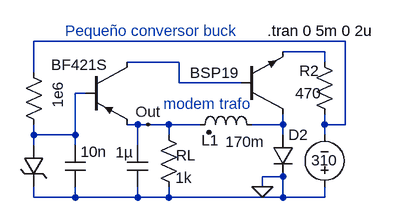
[diagram p0: schematic 2Q_Small_Buck_220_12_NpnOut.asc]
2Q_Small_Buck_220_12_NpnOut.asc, the LTspice schematic file:
Version 4
SHEET 1 1624 1340
WIRE -144 -80 -624 -80
WIRE -176 -64 -240 -64
WIRE -400 -48 -480 -48
WIRE -176 -48 -176 -64
WIRE -624 -32 -624 -80
WIRE -400 -16 -400 -48
WIRE -304 -16 -400 -16
WIRE -544 0 -560 0
WIRE -464 48 -480 48
WIRE -448 48 -464 48
WIRE -416 48 -448 48
WIRE -368 48 -416 48
WIRE -240 48 -240 32
WIRE -240 48 -288 48
WIRE -176 48 -176 32
WIRE -144 48 -144 -80
WIRE -144 48 -176 48
WIRE -624 64 -624 48
WIRE -560 64 -560 0
WIRE -560 64 -624 64
WIRE -416 64 -416 48
WIRE -240 64 -240 48
WIRE -176 64 -176 48
WIRE -624 80 -624 64
WIRE -560 80 -560 64
WIRE -464 80 -464 48
WIRE -240 128 -272 128
WIRE -272 144 -272 128
WIRE -624 160 -624 144
WIRE -560 160 -560 144
WIRE -560 160 -624 160
WIRE -464 160 -464 144
WIRE -464 160 -560 160
WIRE -416 160 -416 144
WIRE -416 160 -464 160
WIRE -240 160 -240 128
WIRE -240 160 -416 160
WIRE -176 160 -176 144
WIRE -176 160 -240 160
FLAG -272 144 0
FLAG -448 48 Out
SYMBOL voltage -176 160 R180
WINDOW 3 0 73 Bottom 0
WINDOW 123 -32 56 VBottom 0
WINDOW 0 -12 58 Invisible 0
SYMATTR Value 310
SYMATTR InstName V2
SYMATTR SpiceLine Rser=.01
SYMBOL ind2 -272 64 M270
WINDOW 0 -24 80 VTop 0
WINDOW 3 5 26 VBottom 0
SYMATTR InstName L1
SYMATTR Value 170m
SYMATTR SpiceLine Rser=140
SYMBOL npn2 -304 32 M180
WINDOW 0 56 32 Invisible 0
WINDOW 3 -79 64 Left 0
SYMATTR InstName Q1
SYMATTR Value BSP19
SYMBOL cap -480 144 M180
WINDOW 0 24 64 Invisible 0
WINDOW 3 -18 53 Left 0
SYMATTR InstName C1
SYMATTR Value 1µ
SYMBOL zener -608 80 M0
WINDOW 0 24 0 Invisible 0
WINDOW 3 24 72 Invisible 0
SYMATTR InstName D1
SYMATTR Value BZX84C12L
SYMBOL pnp2 -544 -48 R0
WINDOW 0 84 32 Invisible 0
WINDOW 3 -53 4 Left 0
SYMATTR InstName Q2
SYMATTR Value BF421S
SYMBOL res -400 160 R180
WINDOW 0 -26 65 Left 0
WINDOW 3 -20 30 Left 0
SYMATTR InstName RL
SYMATTR Value 1k
SYMBOL res -192 -64 R0
WINDOW 0 -23 29 Left 0
WINDOW 3 -29 64 Left 0
SYMATTR InstName R2
SYMATTR Value 470
SYMBOL res -640 -48 R0
WINDOW 0 36 40 Invisible 0
WINDOW 3 53 30 VRight 0
SYMATTR InstName R4
SYMATTR Value 1e6
SYMBOL diode -256 64 R0
WINDOW 3 24 72 Invisible 0
SYMATTR InstName D2
SYMATTR Value GSD2004W-V
SYMBOL cap -576 144 M180
WINDOW 0 24 64 Invisible 0
WINDOW 3 24 54 Left 0
SYMATTR InstName C2
SYMATTR Value 10n
TEXT -264 -96 Left 0 !.tran 0 5m 0 2u
TEXT -576 -96 Left 0 ;Pequeño conversor buck
TEXT -424 16 Left 0 ;modem trafo

The netlist it stands for:
* 2Q_Small_Buck_220_12_NpnOut.asc
V2 0 N001 310 Rser=.01
L1 N005 Out 170m Rser=140
Q1 N005 N003 N002 0 BSP19
C1 0 Out 1µ
D1 N004 0 BZX84C12L
Q2 N003 N004 Out 0 BF421S
RL 0 Out 1k
R2 N002 N001 470
R4 N001 N004 1e6
D2 N005 0 GSD2004W-V
C2 0 N004 10n
.model D D
.lib standard.dio
.model NPN NPN
.model PNP PNP
.lib standard.bjt
.tran 0 5m 0 2u
* Pequeño conversor buck
* modem trafo
.backanno
.end